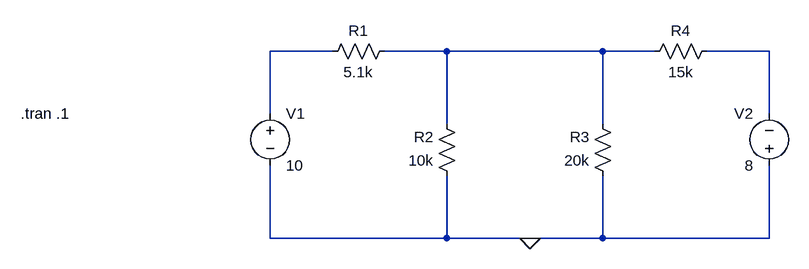
[diagram p0: schematic circuit1.asc]
circuit1.asc, the LTspice schematic file:
Version 4.1
SHEET 1 880 680
WIRE -64 48 -160 48
WIRE 112 48 16 48
WIRE 352 48 112 48
WIRE 432 48 352 48
WIRE 608 48 512 48
WIRE -160 144 -160 48
WIRE 608 144 608 48
WIRE 112 160 112 48
WIRE 352 160 352 48
WIRE -160 336 -160 224
WIRE 112 336 112 240
WIRE 112 336 -160 336
WIRE 240 336 112 336
WIRE 352 336 352 240
WIRE 352 336 240 336
WIRE 608 336 608 224
WIRE 608 336 352 336
FLAG 240 336 0
SYMBOL res 32 32 R90
WINDOW 0 0 56 VBottom 2
WINDOW 3 32 56 VTop 2
SYMATTR InstName R1
SYMATTR Value 5.1k
SYMBOL res 128 256 R180
WINDOW 0 36 76 Left 2
WINDOW 3 36 40 Left 2
SYMATTR InstName R2
SYMATTR Value 10k
SYMBOL res 368 256 R180
WINDOW 0 36 76 Left 2
WINDOW 3 36 40 Left 2
SYMATTR InstName R3
SYMATTR Value 20k
SYMBOL res 416 64 R270
WINDOW 0 32 56 VTop 2
WINDOW 3 0 56 VBottom 2
SYMATTR InstName R4
SYMATTR Value 15k
SYMBOL voltage -160 128 R0
WINDOW 123 0 0 Left 0
WINDOW 39 0 0 Left 0
SYMATTR InstName V1
SYMATTR Value 10
SYMBOL voltage 608 240 R180
WINDOW 0 24 96 Left 2
WINDOW 3 24 16 Left 2
WINDOW 123 0 0 Left 0
WINDOW 39 0 0 Left 0
SYMATTR InstName V2
SYMATTR Value 8
TEXT -544 144 Left 2 !.tran .1

The netlist it stands for:
* circuit1.asc
R1 N002 N001 5.1k
R2 0 N002 10k
R3 0 N002 20k
R4 N002 N003 15k
V1 N001 0 10
V2 0 N003 8
.tran .1
.backanno
.end